# EAGLE design slider (EAGLE 7.7.0)
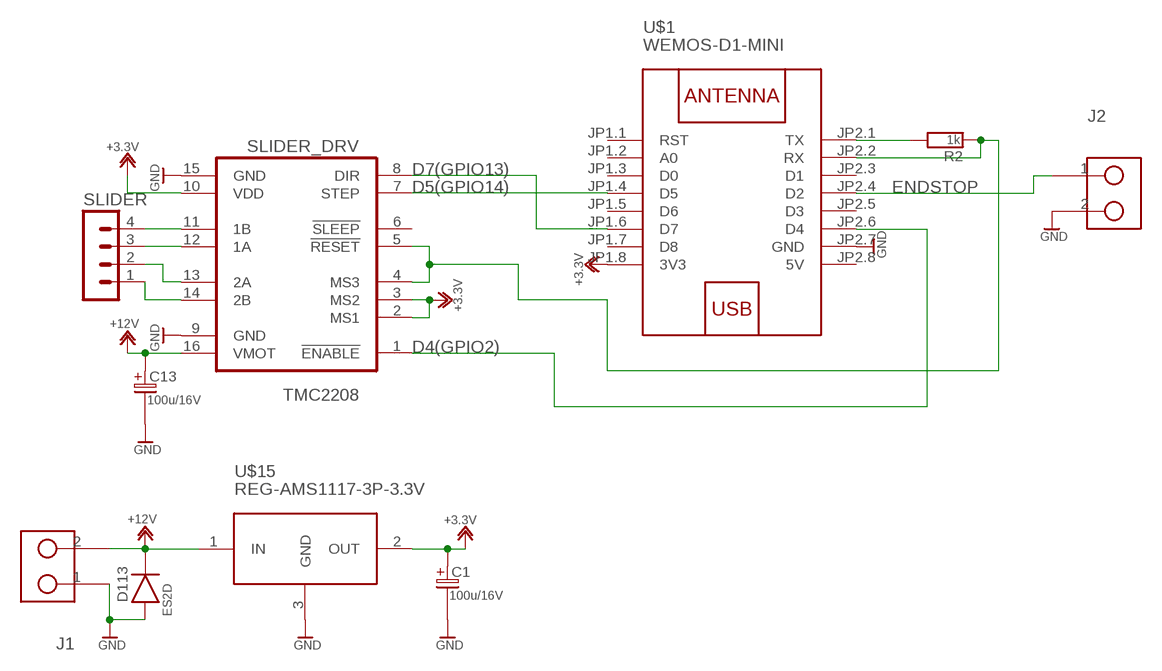
[diagram p0: schematic, sheet 1]

## Parts
C1  100u/16V  C-EL-3,5/8  [ES-3,5/8]
C13  100u/16V  C-EL-3,5/8  [ES-3,5/8]
D113  ES2D  DIODESMB  [SMB]
J1  GMKDS-2  [GMKDS1,5]
J2  GMKDS-2  [GMKDS1,5]
R2  1k  RES-0805  [0805]
SLIDER  MA04-1  [MA04-1]
SLIDER_DRV  TMC2208  POLOLULU2128  [POLOLULU2128]
U$1  WEMOS-D1-MINI  [WEMOS-D1-MINI]
U$15  REG-AMS1117-3P-3.3V  [REG-AMS1117-3P]

## Nets
+3.3V: C1.1 SLIDER_DRV.2(MS1) SLIDER_DRV.3(MS2) SLIDER_DRV.10(VDD) U$1.JP1.8(3V3) U$15.2(OUT)
+12V: C13.1 D113.2(K) J1.2 SLIDER_DRV.16(VMOT) U$15.1(IN)
D4(GPIO2): SLIDER_DRV.1(!ENABLE) U$1.JP2.6(D4)
D5(GPIO14): SLIDER_DRV.7(STEP) U$1.JP1.4(D5)
D7(GPIO13): SLIDER_DRV.8(DIR) U$1.JP1.6(D7)
ENDSTOP: J2.1 U$1.JP2.4(D2)
GND: C1.2 C13.2 D113.1(A) J1.1 J2.2 SLIDER_DRV.9(GND) SLIDER_DRV.15(GND) U$1.JP2.7(GND) U$15.3(GND)
N$2: R2.2 U$1.JP2.1(TX)
N$4: R2.1 SLIDER_DRV.4(MS3) SLIDER_DRV.5(!RESET) U$1.JP2.2(RX)
N$8: SLIDER.4 SLIDER_DRV.11(1B)
N$9: SLIDER.3 SLIDER_DRV.12(1A)
N$10: SLIDER.2 SLIDER_DRV.13(2A)
N$11: SLIDER.1 SLIDER_DRV.14(2B)
Unconnected: SLIDER_DRV.6(!SLEEP) U$1.JP1.1(RST) U$1.JP1.2(A0) U$1.JP1.3(D0) U$1.JP1.5(D6) U$1.JP1.7(D8) U$1.JP2.3(D1) U$1.JP2.5(D3)

## Power pins joined to a net without a drawn wire
5V: U$1.JP2.8(5V)

## Library data of the parts
C1 C13 = DISCRETE_mm:C-EL: Kondesator elektrolityczny przewlekany
D113 = SMD_mm:DIODE: Dioda
J1 J2 = ELFIN:GMKDS-2
R2 = SMD:RES-0805
SLIDER = con-lstb:MA04-1: PIN HEADER; OC_FARNELL: unknown; OC_NEWARK: unknown
SLIDER_DRV = stepper_drivers_etc:POLOLULU2128
U$1 = diy-modules:WEMOS-D1-MINI: WEMOS D1 mini: Mini Wi-Fi Board based on ESP-8266 device More details can be found here: https://www.wemos.cc/product/d1-mini.html Click here to find device on ebay.com <http://www.ebay.com/sch/wemos+d1+mini+nodemcu>
U$15 = diy-modules:REG-AMS1117-3P-*: Linear Regulator based on AMS1117 chip 3-pin version AMS1117 datasheet is available here: http://www.advanced-monolithic.com/pdf/ds1117.pdf Click here to find device on ebay.com <http://www.ebay.com/sch/ams1117+module> Note: There are many variants. Search for the proper version.

## Net classes
0 default: width 0.2 mm, drill 0.25 mm, clearance 0.15 mm

## Board
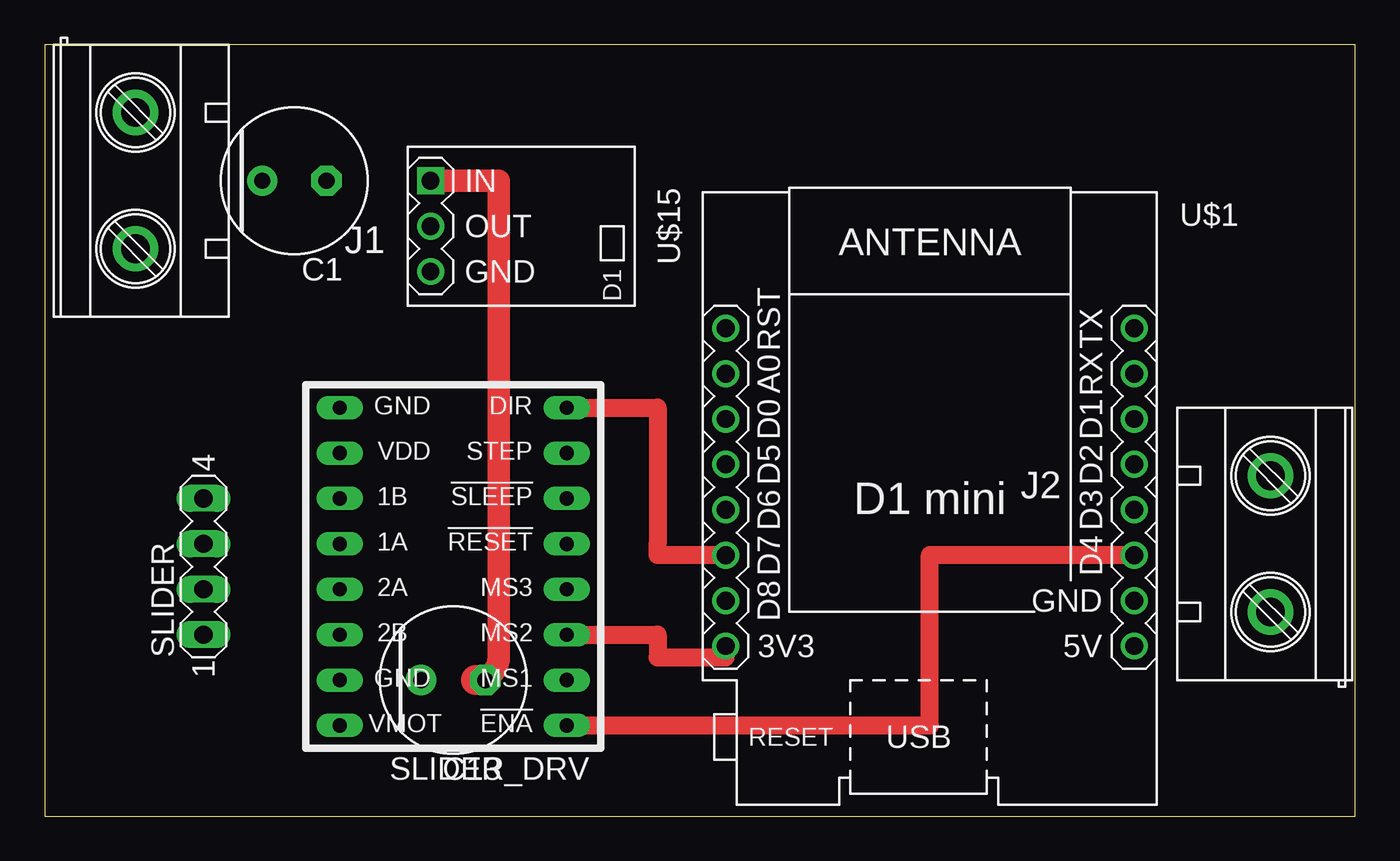
[diagram p1: board, top side]
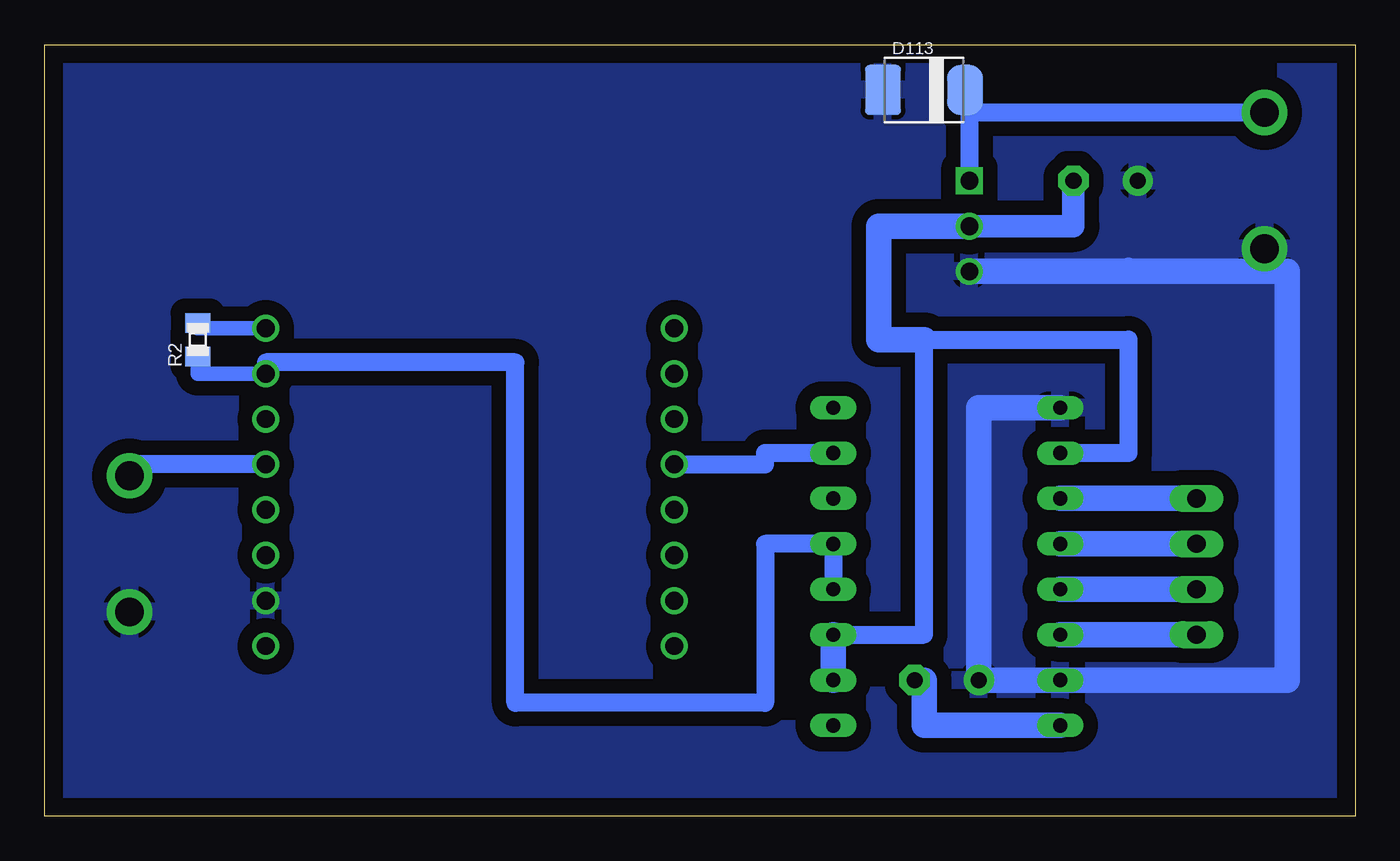
[diagram p2: board, bottom side, seen from below]

Size 73.33 x 43.17 mm. Coordinates in mm from the lower left corner, seen from the top.
Outline: 0,0 73.33,0 73.33,43.17 0,43.17 0,0
Copper layers (1*16): Top 0.035mm / dielectric 1.5mm / Bottom 0.035mm
Design rules "default": minimum track width 10mil, minimum drill 24mil, track to track 8mil, track to pad 8mil, pad to pad 8mil, via to via 8mil, smd to smd 8mil, copper to edge 40mil, drill to drill 8mil, minimum pad ring 10mil, minimum via ring 8mil, stop-mask expansion 4mil, vias tented up to drill 0mil, thermal gap 10mil

### Footprints (pad centres in the part's own frame; a part is rotated, then mirrored left to right if it is on the bottom)
ES-3,5/8 = drill 0.9 pad 1.7 octagon: 1 -1.8,0 | drill 0.9 pad 1.7: 2 1.8,0
SMB = smd 2 x 2.8: 1 -2.3,0; 2 2.3,0
GMKDS1,5 = drill 1.6 pad 2.54: 1 0,3.81; 2 0,-3.81
0805 = smd 1.092 x 1.397: 1 -0.94,0; 2 0.94,0
MA04-1 = drill 1.016 long: 1 -3.81,0; 2 -1.27,0; 3 1.27,0; 4 3.81,0
POLOLULU2128 = drill 0.8 long: 1 -7.62,7.62; 2 -7.62,5.08; 3 -7.62,2.54; 4 -7.62,0; 5 -7.62,-2.54; 6 -7.62,-5.08; 7 -7.62,-7.62; 8 -7.62,-10.16; 9 5.08,-10.16; 10 5.08,-7.62; 11 5.08,-5.08; 12 5.08,-2.54; 13 5.08,0; 14 5.08,2.54; 15 5.08,5.08; 16 5.08,7.62
WEMOS-D1-MINI = drill 1: JP1.1 -11.43,9.525; JP1.2 -11.43,6.985; JP1.3 -11.43,4.445; JP1.4 -11.43,1.905; JP1.5 -11.43,-0.635; JP1.6 -11.43,-3.175; JP1.7 -11.43,-5.715; JP1.8 -11.43,-8.255; JP2.1 11.43,9.525; JP2.2 11.43,6.985; JP2.3 11.43,4.445; JP2.4 11.43,1.905; JP2.5 11.43,-0.635; JP2.6 11.43,-3.175; JP2.7 11.43,-5.715; JP2.8 11.43,-8.255
REG-AMS1117-3P = drill 1 square: 1 -2.54,-5.08 | drill 1: 2 0,-5.08; 3 2.54,-5.08

### Placement (x,y rotation side)
C1  13.97,35.56 180 top
C13  22.86,7.62 180 top
D113  24.13,40.64 0 bottom
J1  5.08,35.56 180 top
J2  68.58,15.24 0 top
R2  64.77,26.67 90 bottom
SLIDER  8.89,13.97 90 top
SLIDER_DRV  21.59,12.7 180 top
U$1  49.53,17.78 0 top
U$15  26.67,33.02 270 top

### Tracks (layer width: path | path; a pad name or v marks a point on that pad's centre or on a via)
+3.3V
  Top 1.016: SLIDER_DRV.3 34.29,10.16 34.29,8.89 38.1,8.89 U$1.JP1.8
  Bottom 1.016: SLIDER_DRV.10 12.7,20.32 12.7,26.67 24.13,26.67 24.13,10.16 SLIDER_DRV.3
  Bottom 1.27: U$15.2 15.77,33.02 C1.1
  Bottom 1.422: SLIDER_DRV.3 SLIDER_DRV.2 | U$15.2 26.67,33.02 26.67,26.67 24.13,26.67
+12V
  Top 1.27: 24.13,7.62 arc90 25.4,8.89 25.4,35.56 U$15.1
  Top 1.676: C13.1 24.13,7.62
  Bottom 1.016: J1.2 21.59,39.37 | 21.59,39.37 U$15.1 | D113.2 21.59,40.64 21.59,39.37
  Bottom 1.422: SLIDER_DRV.16 24.13,5.08 24.13,7.62 C13.1
D4(GPIO2)
  Top 1.016: SLIDER_DRV.1 49.53,5.08 49.53,14.61 U$1.JP2.6
D5(GPIO14)
  Bottom 1.016: SLIDER_DRV.7 33.02,20.32 33.02,19.68 U$1.JP1.4
D7(GPIO13)
  Top 1.016: SLIDER_DRV.8 34.29,22.86 34.29,15.24 34.29,14.61 U$1.JP1.6
ENDSTOP
  Bottom 1.016: U$1.JP2.4 68.58,19.68 J2.1
GND
  Bottom 1.016: 5.08,30.76 5.08,30.48 | 12.7,30.76 12.7,30.48
  Bottom 1.422: SLIDER_DRV.9 21.06,22.86 C13.2 SLIDER_DRV.15 3.81,7.62 3.81,30.48 5.08,30.48 12.7,30.48 U$15.3
  pour Bottom (isolate 0.813): 1.27,41.91 72.39,41.91 72.39,1.27 1.27,1.27
N$2
  Bottom 0.813: U$1.JP2.1 64.77,27.3 R2.2
N$4
  Bottom 0.813: R2.1 64.77,24.77 U$1.JP2.2
  Bottom 1.016: SLIDER_DRV.4 SLIDER_DRV.5 33.02,15.24 33.02,6.35 46.99,6.35 46.99,25.4 60.96,25.4 U$1.JP2.2
N$8
  Bottom 1.422: SLIDER_DRV.11 SLIDER.4
N$9
  Bottom 1.422: SLIDER_DRV.12 SLIDER.3
N$10
  Bottom 1.422: SLIDER_DRV.13 SLIDER.2
N$11
  Bottom 1.422: SLIDER_DRV.14 SLIDER.1